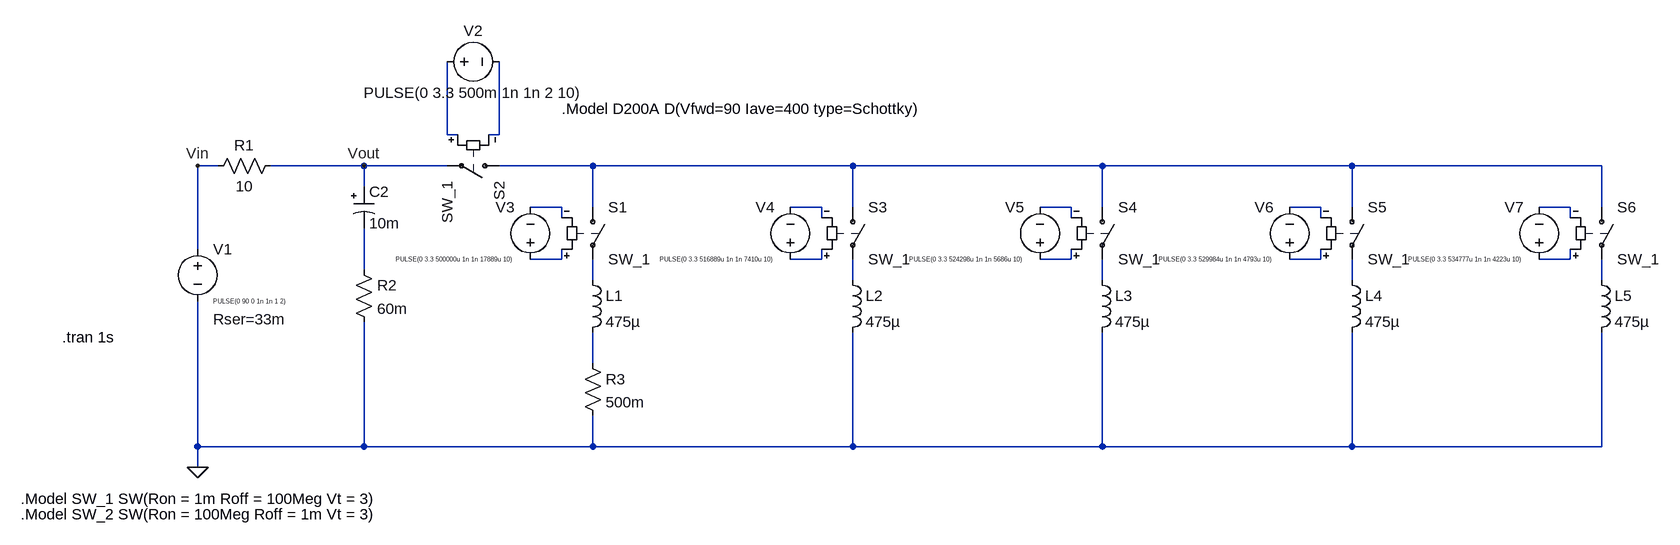
[diagram p0: schematic coilgun2.asc]
coilgun2.asc, the LTspice schematic file:
Version 4.1
SHEET 1 2368 680
WIRE 496 -48 496 -160
WIRE 512 -48 496 -48
WIRE 576 -48 576 -160
WIRE 576 -48 560 -48
WIRE 144 0 112 0
WIRE 368 0 224 0
WIRE 496 0 368 0
WIRE 720 0 576 0
WIRE 1120 0 720 0
WIRE 1504 0 1120 0
WIRE 1888 0 1504 0
WIRE 2272 0 1888 0
WIRE 368 32 368 0
WIRE 672 64 624 64
WIRE 720 64 720 0
WIRE 1072 64 1024 64
WIRE 1120 64 1120 0
WIRE 1456 64 1408 64
WIRE 1504 64 1504 0
WIRE 1840 64 1792 64
WIRE 1888 64 1888 0
WIRE 2224 64 2176 64
WIRE 2272 64 2272 0
WIRE 672 80 672 64
WIRE 1072 80 1072 64
WIRE 1456 80 1456 64
WIRE 1840 80 1840 64
WIRE 2224 80 2224 64
WIRE 112 128 112 0
WIRE 672 144 672 128
WIRE 672 144 624 144
WIRE 1072 144 1072 128
WIRE 1072 144 1024 144
WIRE 1456 144 1456 128
WIRE 1456 144 1408 144
WIRE 1840 144 1840 128
WIRE 1840 144 1792 144
WIRE 2224 144 2224 128
WIRE 2224 144 2176 144
WIRE 368 160 368 96
WIRE 720 176 720 144
WIRE 1120 176 1120 144
WIRE 1504 176 1504 144
WIRE 1888 176 1888 144
WIRE 2272 176 2272 144
WIRE 720 304 720 256
WIRE 112 432 112 208
WIRE 368 432 368 240
WIRE 368 432 112 432
WIRE 720 432 720 384
WIRE 720 432 368 432
WIRE 1120 432 1120 256
WIRE 1120 432 720 432
WIRE 1504 432 1504 256
WIRE 1504 432 1120 432
WIRE 1888 432 1888 256
WIRE 1888 432 1504 432
WIRE 2272 432 2272 256
WIRE 2272 432 1888 432
WIRE 112 464 112 432
FLAG 112 464 0
FLAG 112 0 Vin
FLAG 368 0 Vout
SYMBOL voltage 112 112 R0
WINDOW 123 0 0 Left 0
WINDOW 39 24 124 Left 2
WINDOW 3 24 96 Left 0
SYMATTR SpiceLine Rser=33m
SYMATTR InstName V1
SYMATTR Value PULSE(0 90 0 1n 1n 1 2)
SYMBOL polcap 352 32 R0
SYMATTR InstName C2
SYMATTR Value 10m
SYMATTR SpiceLine V=100
SYMBOL res 240 -16 R90
WINDOW 0 0 56 VBottom 2
WINDOW 3 32 56 VTop 2
SYMATTR InstName R1
SYMATTR Value 10
SYMBOL ind 704 160 R0
SYMATTR InstName L1
SYMATTR Value 475µ
SYMBOL sw 592 0 R90
SYMATTR InstName S2
SYMATTR Value SW_1
SYMBOL voltage 480 -160 R270
WINDOW 0 32 56 VTop 2
WINDOW 3 -32 56 VBottom 2
WINDOW 123 0 0 Left 0
WINDOW 39 0 0 Left 0
SYMATTR InstName V2
SYMATTR Value PULSE(0 3.3 500m 1n 1n 2 10)
SYMBOL sw 720 48 R0
SYMATTR InstName S1
SYMATTR Value SW_1
SYMBOL voltage 624 160 R180
WINDOW 0 24 96 Left 2
WINDOW 3 24 16 Left 0
WINDOW 123 0 0 Left 0
WINDOW 39 0 0 Left 0
SYMATTR InstName V3
SYMATTR Value PULSE(0 3.3 500000u 1n 1n 17889u 10)
SYMBOL ind 1104 160 R0
SYMATTR InstName L2
SYMATTR Value 475µ
SYMBOL sw 1120 48 R0
SYMATTR InstName S3
SYMATTR Value SW_1
SYMBOL voltage 1024 160 R180
WINDOW 0 24 96 Left 2
WINDOW 3 24 16 Left 0
WINDOW 123 0 0 Left 0
WINDOW 39 0 0 Left 0
SYMATTR InstName V4
SYMATTR Value PULSE(0 3.3 516889u 1n 1n 7410u 10)
SYMBOL ind 1488 160 R0
SYMATTR InstName L3
SYMATTR Value 475µ
SYMBOL sw 1504 48 R0
SYMATTR InstName S4
SYMATTR Value SW_1
SYMBOL voltage 1408 160 R180
WINDOW 0 24 96 Left 2
WINDOW 3 24 16 Left 0
WINDOW 123 0 0 Left 0
WINDOW 39 0 0 Left 0
SYMATTR InstName V5
SYMATTR Value PULSE(0 3.3 524298u 1n 1n 5686u 10)
SYMBOL ind 1872 160 R0
SYMATTR InstName L4
SYMATTR Value 475µ
SYMBOL sw 1888 48 R0
SYMATTR InstName S5
SYMATTR Value SW_1
SYMBOL voltage 1792 160 R180
WINDOW 0 24 96 Left 2
WINDOW 3 24 16 Left 0
WINDOW 123 0 0 Left 0
WINDOW 39 0 0 Left 0
SYMATTR InstName V6
SYMATTR Value PULSE(0 3.3 529984u 1n 1n 4793u 10)
SYMBOL ind 2256 160 R0
SYMATTR InstName L5
SYMATTR Value 475µ
SYMBOL sw 2272 48 R0
SYMATTR InstName S6
SYMATTR Value SW_1
SYMBOL voltage 2176 160 R180
WINDOW 0 24 96 Left 2
WINDOW 3 24 16 Left 0
WINDOW 123 0 0 Left 0
WINDOW 39 0 0 Left 0
SYMATTR InstName V7
SYMATTR Value PULSE(0 3.3 534777u 1n 1n 4223u 10)
SYMBOL res 352 144 R0
SYMATTR InstName R2
SYMATTR Value 60m
SYMBOL res 704 288 R0
SYMATTR InstName R3
SYMATTR Value 500m
TEXT -96 264 Left 2 !.tran 1s
TEXT -160 512 Left 2 !.Model SW_1 SW(Ron = 1m Roff = 100Meg Vt = 3)
TEXT -160 536 Left 2 !.Model SW_2 SW(Ron = 100Meg Roff = 1m Vt = 3)
TEXT 672 -88 Left 2 !.Model D200A D(Vfwd=90 Iave=400 type=Schottky)

The netlist it stands for:
* coilgun2.asc
V1 Vin 0 PULSE(0 90 0 1n 1n 1 2) Rser=33m
C2 Vout N014 10m V=100
R1 Vout Vin 10
L1 N015 N020 475µ
S2 N003 Vout N001 N002 SW_1
V2 N001 N002 PULSE(0 3.3 500m 1n 1n 2 10)
S1 N003 N015 N009 N004 SW_1
V3 N009 N004 PULSE(0 3.3 500000u 1n 1n 17889u 10)
L2 N016 0 475µ
S3 N003 N016 N010 N005 SW_1
V4 N010 N005 PULSE(0 3.3 516889u 1n 1n 7410u 10)
L3 N017 0 475µ
S4 N003 N017 N011 N006 SW_1
V5 N011 N006 PULSE(0 3.3 524298u 1n 1n 5686u 10)
L4 N018 0 475µ
S5 N003 N018 N012 N007 SW_1
V6 N012 N007 PULSE(0 3.3 529984u 1n 1n 4793u 10)
L5 N019 0 475µ
S6 N003 N019 N013 N008 SW_1
V7 N013 N008 PULSE(0 3.3 534777u 1n 1n 4223u 10)
R2 N014 0 60m
R3 N020 0 500m
.tran 1s
.Model SW_1 SW(Ron = 1m Roff = 100Meg Vt = 3)
.Model SW_2 SW(Ron = 100Meg Roff = 1m Vt = 3)
.Model D200A D(Vfwd=90 Iave=400 type=Schottky)
.backanno
.end